# EAGLE design newDCDC (EAGLE 9.0.1)
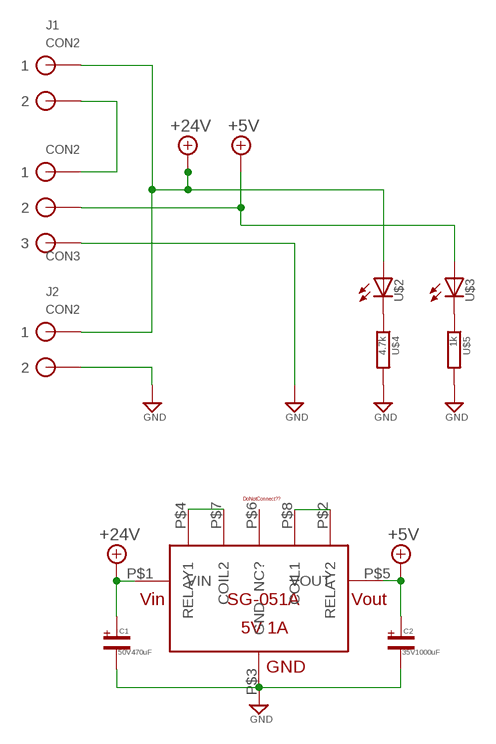
[diagram p0: schematic, sheet 1]

## Parts
C1  50V470uF  コンデンサ(電解)E5-10.5  [D=2,φ=10,5]
C2  35V1000uF  コンデンサ(電解)E5-13  [D=2,φ=13]
CON2  CON3  [CON3]
J1  CON2  [CON2]
J2  CON2  [CON2]
U$1  SG-051A  [SG-051A]
U$2  LED(砲弾型)3  [LED3MM]
U$3  LED(砲弾型)3  [LED3MM]
U$4  4.7k  抵抗0805  [0805(JIS2012)HAND]
U$5  1k  抵抗0805  [0805(JIS2012)HAND]

## Nets
+5V: C2.+ CON2.P$2 U$1.P$5(VOUT) U$3.A
+24V: C1.+ J1.P$1 J2.P$1 U$1.P$1(VIN) U$2.A
GND: C1.- C2.- CON2.P$3 J2.P$2 U$1.P$3(GND) U$4.2 U$5.2
N$2: CON2.P$1 J1.P$2
N$4: U$1.P$4(RELAY1) U$1.P$7(COIL2)
N$5: U$1.P$2(RELAY2) U$1.P$8(COIL1)
N$9: U$2.K U$4.1
N$10: U$3.K U$5.1
Unconnected: U$1.P$6(NC?)

## Library data of the parts
C1 C2 = (Foundation)電解コンデンサ:コンデンサ(電解): POLARIZED CAPACITOR, European symbol
CON2 = (コネクタ)XH:CON3: low insertion CON
J1 J2 = (コネクタ)XH:CON2: low insertion CON
U$1 = (DC降圧)SG-051A:SG-051A
U$2 U$3 = (半導体)LED:LED(砲弾型)
U$4 U$5 = (Foundation)表面実装RC:抵抗

## Board
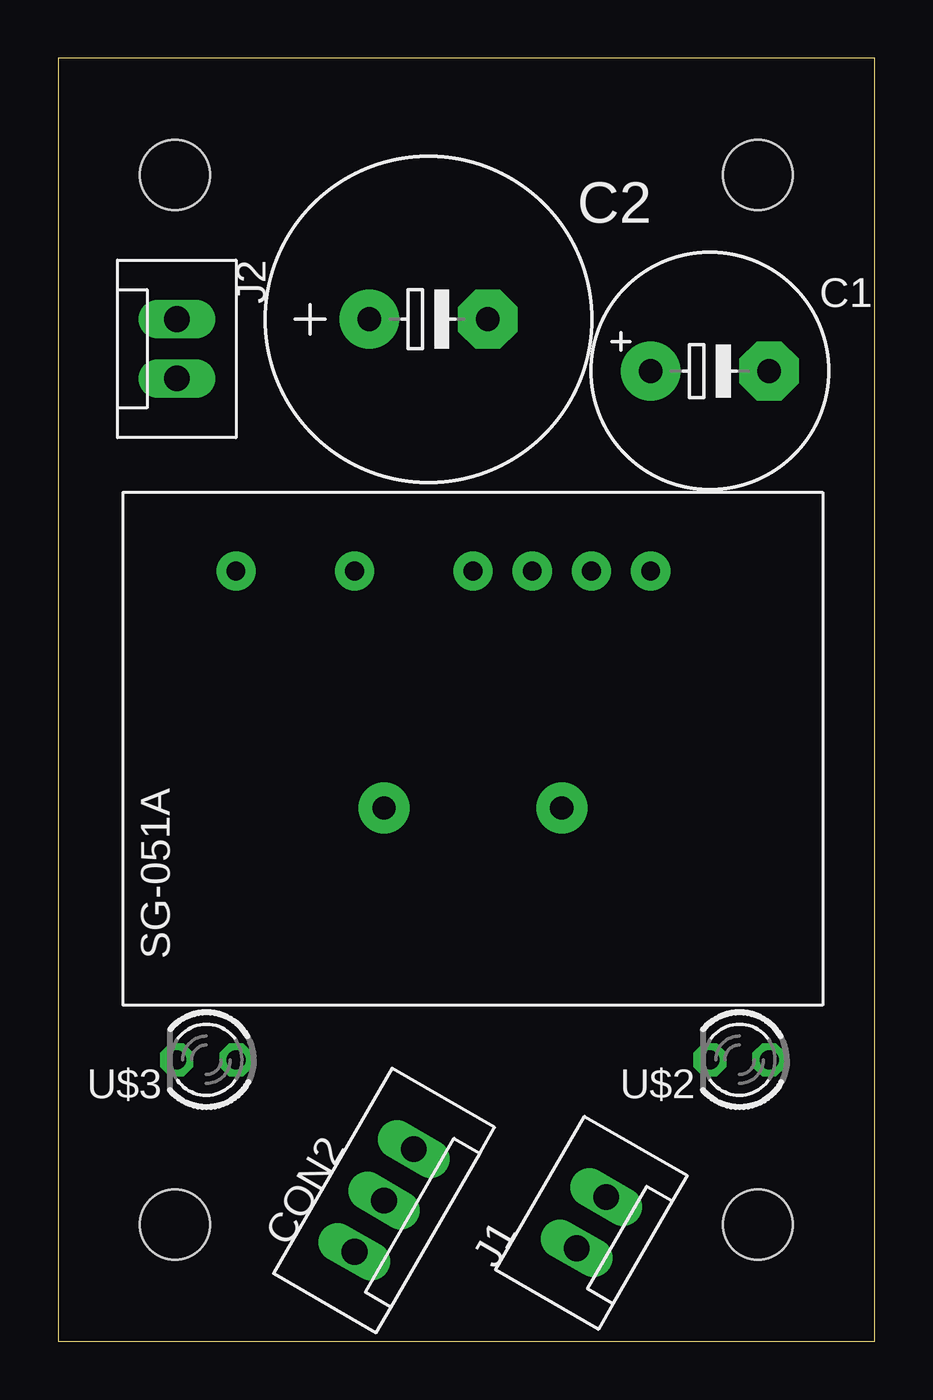
[diagram p1: board, top side]
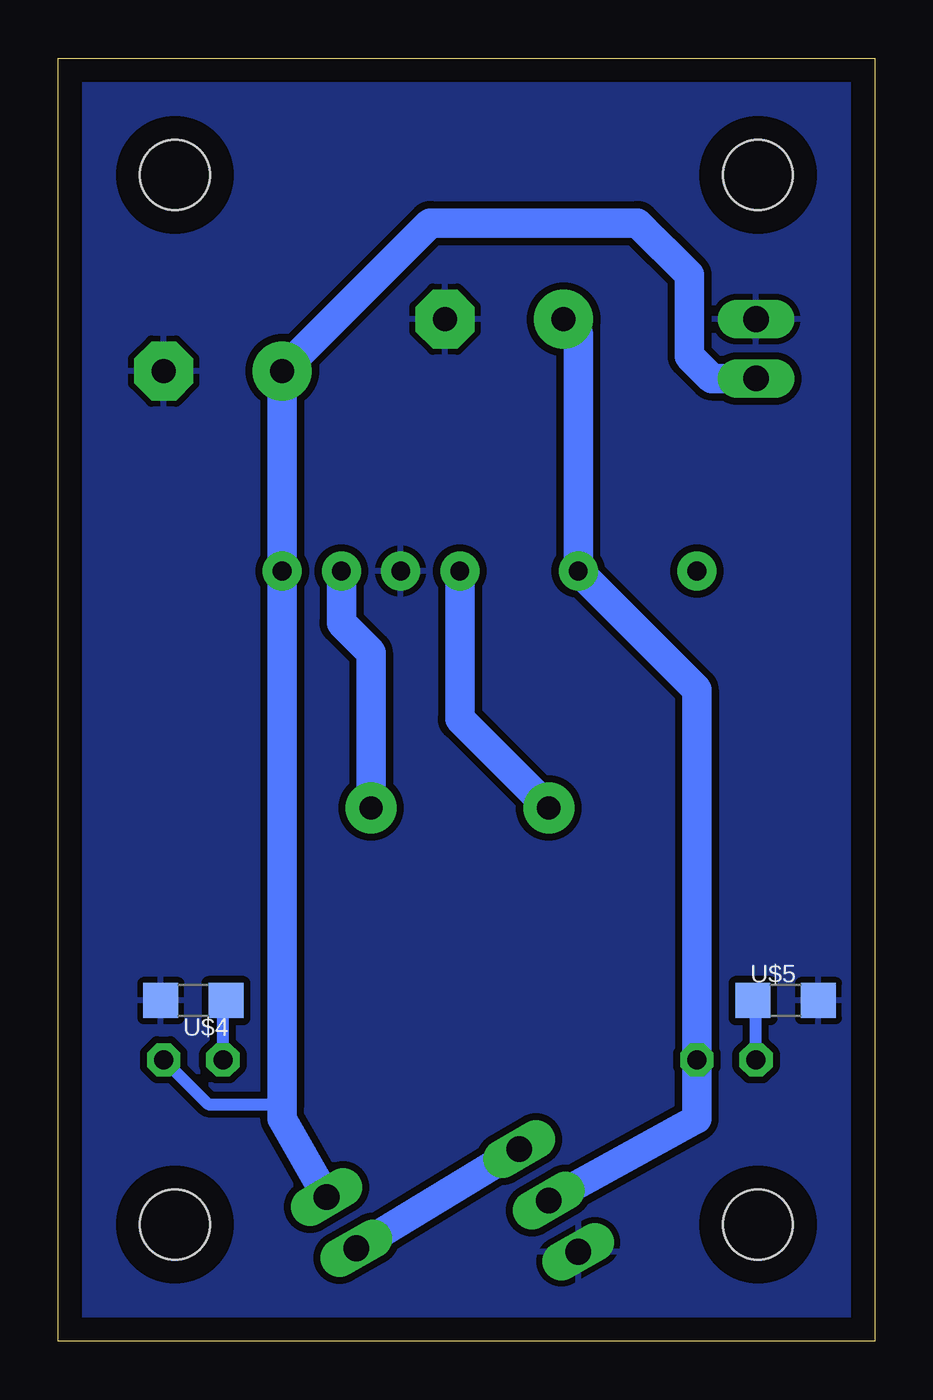
[diagram p2: board, bottom side, seen from below]

Size 35 x 55 mm. Coordinates in mm from the lower left corner, seen from the top.
Outline: 0,0 35,0 35,55 0,55 0,0
Copper layers (1*16): Top 0.035mm / dielectric 1.5mm / Bottom 0.035mm
Design rules "default *": minimum track width 6mil, minimum drill 0.35mm, track to track 12mil, track to pad 12mil, pad to pad 12mil, via to via 12mil, smd to smd 12mil, copper to edge 40mil, drill to drill 6mil, minimum pad ring 10mil, minimum via ring 8mil, stop-mask expansion 4mil, vias tented up to drill 0mil, thermal gap 10mil
Holes 3 mm at 5,5 30,5 5,50 30,50

### Footprints (pad centres in the part's own frame; a part is rotated, then mirrored left to right if it is on the bottom)
D=2,φ=10,5 = drill 1.016 pad 2.54: + -2.54,0 | drill 1.016 pad 2.54 octagon: - 2.54,0
D=2,φ=13 = drill 1.016 pad 2.54: + -2.54,0 | drill 1.016 pad 2.54 octagon: - 2.54,0
CON3 = drill 1.1 long: P$1 2.54,0; P$2 0,0; P$3 -2.54,0
CON2 = drill 1.1 long: P$1 1.27,0; P$2 -1.27,0
SG-051A = drill 0.8 pad 1.676: P$1 7.62,-7.62; P$2 7.62,-5.08; P$3 7.62,-2.54; P$4 7.62,0; P$5 7.62,5.08; P$6 7.62,10.16 | drill 1 pad 2.184: P$7 -2.54,3.81; P$8 -2.54,-3.81
LED3MM = drill 0.813 pad 1.422 octagon: A -1.27,0; K 1.27,0
0805(JIS2012)HAND = smd 1.5 x 1.5: 1 -1.4,0; 2 1.4,0

### Placement (x,y rotation side)
C1  27.94,41.59 0 top
C2  15.88,43.81 0 top
CON2  13.97,6.03 60 top
J1  22.86,5.08 60 top
J2  5.08,42.55 270 top
U$1  17.78,25.4 90 top
U$2  29.21,12.06 180 top
U$3  6.35,12.06 180 top
U$4  29.21,14.61 180 bottom
U$5  3.81,14.61 0 bottom

### Tracks (layer width: path | path; a pad name or v marks a point on that pad's centre or on a via)
+5V
  Bottom 1.27: C2.+ 12.7,43.18 U$1.P$5 7.62,27.94 U$3.A 7.62,9.53 CON2.P$2
+24V
  Bottom 0.508: U$2.A 28.57,10.16 25.4,10.16
  Bottom 1.27: J1.P$1 25.4,9.53 25.4,10.16 U$1.P$1 C1.+ 19.05,47.94 10.16,47.94 7.94,45.72 7.94,42.23 6.99,41.27 J2.P$1
GND
  pour Bottom: 0,55 35,55 35,0 0,0
N$2
  Bottom 1.27: CON2.P$1 J1.P$2
N$4
  Bottom 1.27: U$1.P$4 17.78,26.67 U$1.P$7
N$5
  Bottom 1.27: U$1.P$2 22.86,30.8 21.59,29.53 U$1.P$8
N$9
  Bottom 0.508: U$2.K 27.94,14.47 arc90 U$4.1
N$10
  Bottom 0.508: U$3.K 5.08,14.47 arc-90 U$5.1

### Text on the board
Char: 5 | 24 | PWR24 | Vout | SW